# Altium schematic sheet Ethernet.SchDoc
size A4
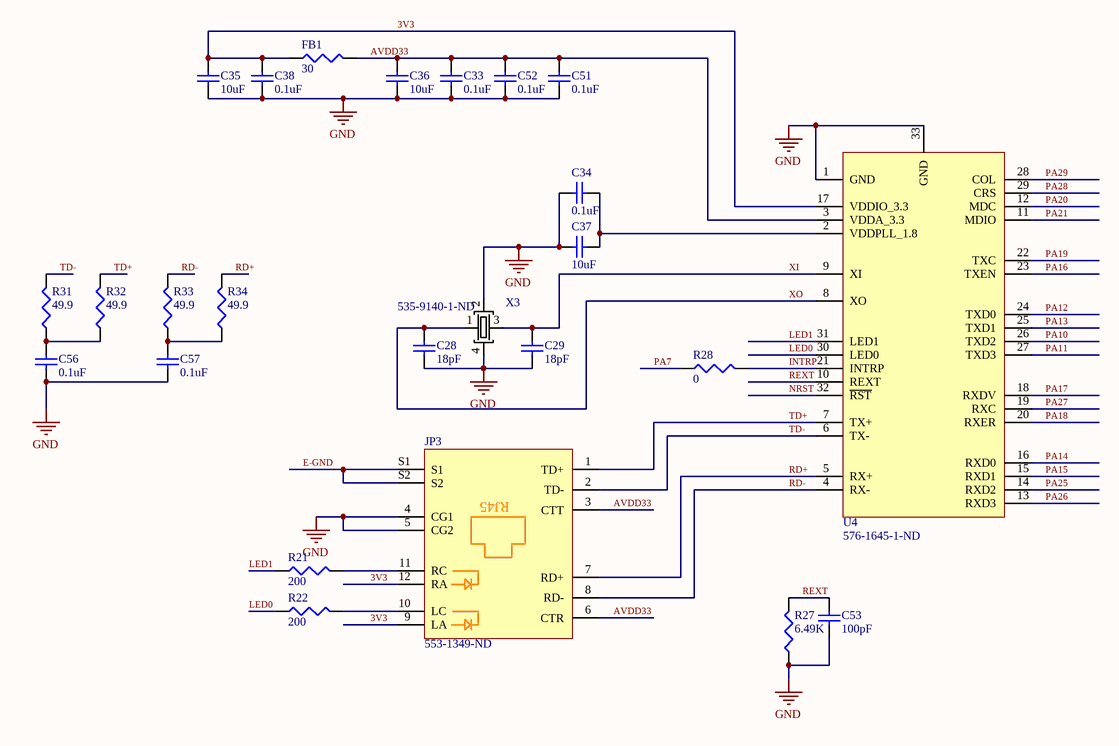
[diagram p0: Ethernet.SchDoc]

## Parts
C28  value 18pF  [0402]  (hidden comment: C0402_a_18pF)
C29  value 18pF  [0402]  (hidden comment: C0402_a_18pF)
C33  value 0.1uF  [0402]  (hidden comment: C0402_c_0.1uF)
C34  value 0.1uF  [0402]  (hidden comment: C0402_c_0.1uF)
C35  value 10uF  [0805]  (hidden comment: C0805_c_10uF)
C36  value 10uF  [0805]  (hidden comment: C0805_c_10uF)
C37  value 10uF  [0805]  (hidden comment: C0805_c_10uF)
C38  value 0.1uF  [0402]  (hidden comment: C0402_c_0.1uF)
C51  value 0.1uF  [0402]  (hidden comment: C0402_c_0.1uF)
C52  value 0.1uF  [0402]  (hidden comment: C0402_c_0.1uF)
C53  value 100pF  [0402]  (hidden comment: C0402_a_100pF)
C56  value 0.1uF  [0402]  (hidden comment: C0402_c_0.1uF)
C57  value 0.1uF  [0402]  (hidden comment: C0402_c_0.1uF)
FB1  Value @ 100MHz: 30  [0805]  (hidden comment: Murata_a_0805_30_Ohm_100Mhz)
JP3  Supplier Part Number 1: 553-1349-ND  [RJ45]  (hidden comment: Ethernet connector)
R21  value 200  [RES0805]  (hidden comment: Susumu_0805_a3_200)
R22  value 200  [RES0805]  (hidden comment: Susumu_0805_a3_200)
R27  value 6.49K  [RES0805]  (hidden comment: Stackpole_0805_b1_6.49K)
R28  value 0  [RES0805]  (hidden comment: Vishay_0805_a1_0.0)
R31  value 49.9  [RES0805]  (hidden comment: Susumu_0805_a1_49.9)
R32  value 49.9  [RES0805]  (hidden comment: Susumu_0805_a1_49.9)
R33  value 49.9  [RES0805]  (hidden comment: Susumu_0805_a1_49.9)
R34  value 49.9  [RES0805]  (hidden comment: Susumu_0805_a1_49.9)
U4  Supplier Part Number 1: 576-1645-1-ND  [QFN50P500X500X85-32N]  (hidden comment: 10Base-T/100Base-TX Physical Layer Transceiver)
X3  Supplier Part Number 1: 535-9140-1-ND  [Crystal Footprint]  (hidden comment: Crystal_25.000MHz)

## Nets
GND: C28.1 C29.1 C33.1 C34.1 C35.1 C36.1 C37.1 C38.1 C51.1 C52.1 C53.1 C56.1 C57.1 JP3.4(CG1) JP3.5(CG2) R27.1 U4.1(GND) U4.33(GND) X3.2(GND) X3.4(GND)
3V3: C35.2 C38.2 FB1.1 JP3.9(LA) JP3.12(RA) U4.17(VDDIO_3.3)
AVDD33: C33.2 C36.2 C51.2 C52.2 FB1.2 JP3.3(CTT) JP3.6(CTR) U4.3(VDDA_3.3)
E-GND: JP3.S1 JP3.S2
INTRP: R28.2 U4.21(INTRP)
LED0: R22.1 U4.30(LED0)
LED1: R21.1 U4.31(LED1)
NRST: U4.32(~{RST})
PA7: R28.1
PA10: U4.26(TXD2)
PA11: U4.27(TXD3)
PA12: U4.24(TXD0)
PA13: U4.25(TXD1)
PA14: U4.16(RXD0)
PA15: U4.15(RXD1)
PA16: U4.23(TXEN)
PA17: U4.18(RXDV)
PA18: U4.20(RXER)
PA19: U4.22(TXC)
PA20: U4.12(MDC)
PA21: U4.11(MDIO)
PA25: U4.14(RXD2)
PA26: U4.13(RXD3)
PA27: U4.19(RXC)
PA28: U4.29(CRS)
PA29: U4.28(COL)
RD+: JP3.7(RD+) R34.2 U4.5(RX+)
RD-: JP3.8(RD-) R33.2 U4.4(RX-)
REXT: C53.2 R27.2 U4.10(REXT)
TD+: JP3.1(TD+) R32.2 U4.7(TX+)
TD-: JP3.2(TD-) R31.2 U4.6(TX-)
XI: C29.2 U4.9(XI) X3.3
XO: C28.2 U4.8(XO) X3.1
NetC34_2: C34.2 C37.2 U4.2(VDDPLL_1.8)
NetC56_2: C56.2 R31.1 R32.1
NetC57_2: C57.2 R33.1 R34.1
NetJP3_10: JP3.10(LC) R22.2
NetJP3_11: JP3.11(RC) R21.2

## Notes on the sheet
- (in symbol Ethernet connector) RJ45

## Library data of the parts
C28 C29 = C0402_a_18pF: Ceramic Chip Capacitor - 18pF; Note: Footprint corresponds to dimensions for bulk cassette packaging. This case size has tightened tolerances.; Published: 17-Jul-2002; LatestRevisionDate: 19-Mar-2004; LatestRevisionNote: Silkscreen size reduced.; DatasheetDocument: Mar-2001; PackageDocument: Mar-2001; PackageReference: 0402; Publisher: Altium Limited; Code_JEITA: 0402; Code_IPC: 1005 [0402]; ComponentLink1Description: Manufacturer Link; ComponentLink1URL: http://www.kemet.com/; ComponentLink2Description: Datasheet; ComponentLink2URL: http://www.kemet.com/kemet/web/homepage/kechome.nsf/vapubfilesname/F3102TA.pdf/$file/F3102TA.pdf; Supplier 1: Digi-Key; Supplier Part Number 1: 490-1281-1-ND
C33 C34 C38 C51 C52 C56 C57 = C0402_c_0.1uF: Ceramic Chip Capacitor - 0.1uF; Note: Footprint corresponds to dimensions for bulk cassette packaging. This case size has tightened tolerances.; Published: 17-Jul-2002; LatestRevisionDate: 19-Mar-2004; LatestRevisionNote: Silkscreen size reduced.; DatasheetDocument: Mar-2001; PackageDocument: Mar-2001; PackageReference: 0402; Publisher: Altium Limited; Code_JEITA: 0402; Code_IPC: 1005 [0402]; ComponentLink1Description: Manufacturer Link; ComponentLink1URL: http://www.kemet.com/; ComponentLink2Description: Datasheet; ComponentLink2URL: http://www.kemet.com/kemet/web/homepage/kechome.nsf/vapubfilesname/F3102TA.pdf/$file/F3102TA.pdf; Supplier 1: Digi-Key; Supplier Part Number 1: 399-3521-1-ND
C35-C37 = C0805_c_10uF: Ceramic Chip Capacitor - 10uF; Note: Footprint corresponds to dimensions for bulk cassette packaging. This case size has tightened tolerances.; Published: 17-Jul-2002; LatestRevisionDate: 19-Mar-2004; LatestRevisionNote: Silkscreen size reduced.; DatasheetDocument: Mar-2001; PackageDocument: Mar-2001; PackageReference: 0805; Publisher: Altium Limited; Code_JEITA: 0805; Code_IPC: 2012[0805]; ComponentLink1Description: Manufacturer Link; ComponentLink1URL: http://www.kemet.com/; ComponentLink2Description: Datasheet; ComponentLink2URL: http://www.kemet.com/kemet/web/homepage/kechome.nsf/vapubfilesname/F3102TA.pdf/$file/F3102TA.pdf; Supplier 1: Digi-Key; Supplier Part Number 1: 587-1299-1-ND
C53 = C0402_a_100pF: Ceramic Chip Capacitor - 100pF; Note: Footprint corresponds to dimensions for bulk cassette packaging. This case size has tightened tolerances.; Published: 17-Jul-2002; LatestRevisionDate: 19-Mar-2004; LatestRevisionNote: Silkscreen size reduced.; DatasheetDocument: Mar-2001; PackageDocument: Mar-2001; PackageReference: 0402; Publisher: Altium Limited; Code_JEITA: 0402; Code_IPC: 1005 [0402]; ComponentLink1Description: Manufacturer Link; ComponentLink1URL: http://www.kemet.com/; ComponentLink2Description: Datasheet; ComponentLink2URL: http://www.kemet.com/kemet/web/homepage/kechome.nsf/vapubfilesname/F3102TA.pdf/$file/F3102TA.pdf; Supplier 1: Digi-Key; Supplier Part Number 1: 399-3194-1-ND
FB1 = Murata_a_0805_30_Ohm_100Mhz: FERRITE CHIP 30 OHM 3000MA 0805; Supplier 1: Digi-Key; Supplier Part Number 1: 490-1052-1-ND
JP3 = Ethernet connector: CONN PULSEJACK 1PORT 10/100B-TX; Manufacturer: Pulse; Supplier 1: Digi-Key
R21 R22 = Susumu_0805_a3_200: RES 200 OHM 1/10W .5% 0805 SMD; Supplier 1: Digi-Key; Supplier Part Number 1: RR12P200DCT-ND
R27 = Stackpole_0805_b1_6.49K: RES 6.49K OHM 1/4W 1% 0805 SMD; Supplier 1: Digi-Key; Supplier Part Number 1: RNCP0805FTD6K49CT-ND
R31-R34 = Susumu_0805_a1_49.9: RES 49.9 OHM 1/10W .5% 0805 SMD; Manufacturer: Susumu; Supplier 1: Digi-Key; Supplier Part Number 1: RR12Q49.9DCT-ND; Datasheet: http://www.susumu-usa.com/pdf/products_12.pdf
U4 = 10Base-T/100Base-TX Physical Layer Transceiver: Manufacturer: Micrel INC.; Supplier 1: Digi-Key
X3 = Crystal_25.000MHz: Crystal 25.000MHz 18PF SMD; Manufacturer: Abracon Corporation; Value: 25MHz; Supplier 1: Digi-Key
R28 = Vishay_0805_a1_0.0: Supplier 1: Digi-Key; Supplier Part Number 1: MCU0805-0.0-ZZCT-ND